# Altium project Laser Power Meter.PrjPcb (part 1 of 2)
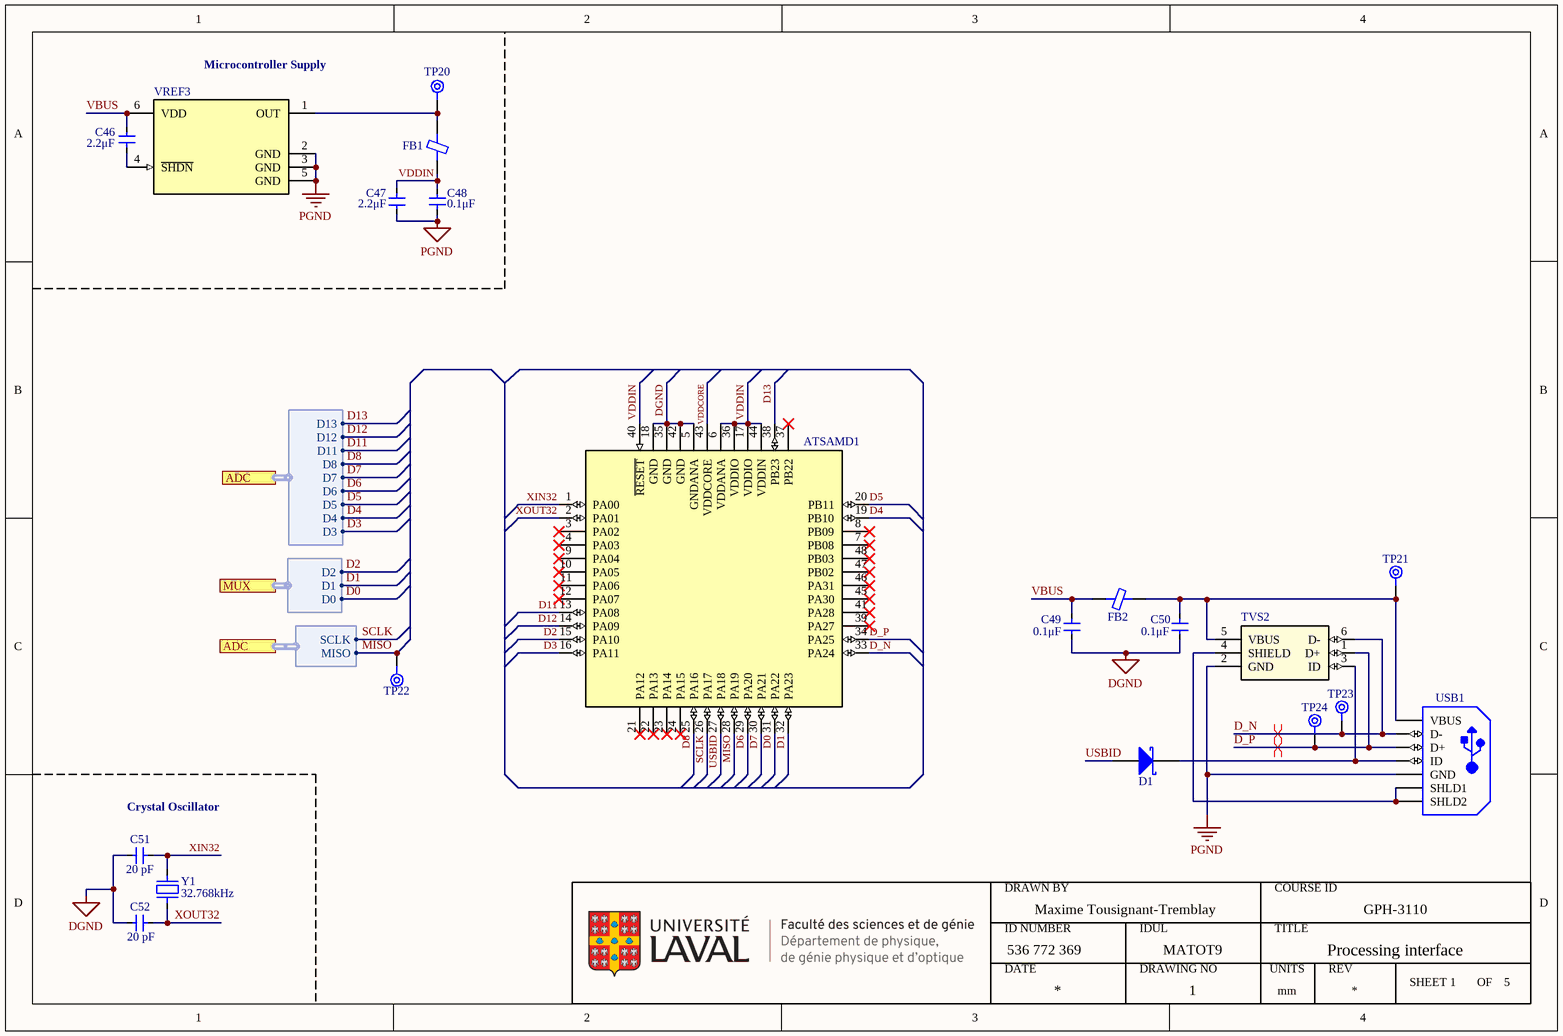
[diagram p0: Arduino.SchDoc]
Author: Maxime Tousignant-Tremblay; CAGE_CODE: ?????; CONTRACT_NUMBER: <CONTRACT NO>; CourseID: GPH-3110; DOC_NO_ASSY_DWG: <ASSY DWG NO>; DOC_NO_BOM: <BOM DOC NO>; DOC_NO_FAB_DWG: <FAB DWG NO>; DOC_NO_SCH_DWG: <SCH DWG NO>; DrawnBy: Maxime Tousignant-Tremblay; ID Number: 536 772 369; IDUL: MATOT9; PCB_2_DEC_TOL: +/-.01; PCB_3_DEC_TOL: +/-.010; PCB_ANG_TOL: +/-1/2; PCB_ASSEMBLY_NO: <PCB ASSY NO>; PCB_CHECKER: - -----; PCB_CHECKER_APP_DATE: --/--/----; PCB_DESIGNER: - -----; PCB_DESIGNER_APP_DATE: --/--/----; PCB_DWG_NO: <PCB DWG NO>; PCB_ENGINEER: - -----; PCB_ENGINEER_APP_DATE: --/--/----; PCB_PART_NUMBER: <PCB PN>; PCB_REV: A; SCH_REV: A; SheetNumber: =SheetNumber; Units: mm
5 sheets, 152 parts. Net scope: flat (ports and power ports of the same name join across sheets).
Board file: 4 Layers Motherboard.PcbDoc
Sheets:
  Arduino.SchDoc
  Power Supply Unit.SchDoc
  Wheatstone bridge part I.SchDoc
  Wheatstone bridge part II.SchDoc
  Wheatstone bridge part III.SchDoc

## Sheet Arduino.SchDoc: Processing interface
size A4; SheetNumber: 1; SheetTotal: 5; ENG_APP_DATE: --/--/--; DSN_APP_DATE: --/--/--; CHK_APP_DATE: --/--/--; SPICEModelCacheCJHNTGTK: <root> / <DocumentId>CJHNTGTK</DocumentId> / </root>

### Parts
ATSAMD1  (no value)  [ATSAMD21G18-AU]
C46  value 2.2μF  [Cap Ceramic 2.2 uF 6.3V SMT 0603]  (hidden comment: Cap Ceramic 2.2 uF SMT 0603)
C47  value 2.2μF  [Cap Ceramic 2.2 uF 6.3V SMT 0603]  (hidden comment: CC0603KRX7R5BB225)
C48  Capacitance: 0.1μF  [Cap Ceramic 0.1 uF 50V SMT 0603]  (hidden comment: Cap Ceramic 0.1 uF SMT 0603)
C49  Capacitance: 0.1μF  [Cap Ceramic 0.1 uF 50V SMT 0603]  (hidden comment: Cap Ceramic 0.1 uF SMT 0603)
C50  Capacitance: 0.1μF  [Cap Ceramic 0.1 uF 50V SMT 0603]  (hidden comment: Cap Ceramic 0.1 uF SMT 0603)
C51  Capacitance: 20 pF  [Capacitor 20 pF SMT 0603]  (hidden comment: CC0603JRNPO9BN200)
C52  Capacitance: 20 pF  [Capacitor 20 pF SMT 0603]  (hidden comment: CC0603JRNPO9BN200)
D1  NSR0530HT1G  [Schottky Diode 30V SMT]  (value not drawn)
FB1  MFBM1V1608-000-R  [Eaton Ferrite Bead 0603]  (value not drawn)
FB2  MFBM1V1608-000-R  [Eaton Ferrite Bead 0603]  (value not drawn)
TP20  Test Point  [SQ Pad]  (value not drawn)  (no BOM)
TP21  Test Point  [SQ Pad]  (value not drawn)  (no BOM)
TP22  Test Point  [SQ Pad]  (value not drawn)  (no BOM)
TP23  Test Point  [SQ Pad]  (value not drawn)  (no BOM)
TP24  Test Point  [SQ Pad]  (value not drawn)  (no BOM)
TVS2  USB OTG TVS Diode Array 25V Clamp SMD  [RCLAMP0504FA.TCT]  (value not drawn)
USB1  USB3106-30-0230-A  [USB Micro-AB Connector B]  (value not drawn)
VREF3  Voltage Reference Series Fixed 3.3V  [MCP1501T-XXE/CHY]  (value not drawn)
Y1  value 32.768kHz  [ABS07-120-32.768KHZ-T A]  (hidden comment: ABS07-120-32.768KHZ-T)

### Ports
ADC (harness 2), ADC (harness 19), MUX (harness 0)

### Harnesses
2: D3, D4, D5, D6, D7, D8, D11, D12, D13
0: D2, D1, D0
19: SCLK, MISO

### Nets
DGND: ATSAMD1.5(GNDANA) ATSAMD1.18(GND) ATSAMD1.35(GND) ATSAMD1.42(GND) C47.1 C48.2 C49.1 C50.1 C51.1 C52.1 TVS2.2(GND) USB1.5(GND) VREF3.2(GND) VREF3.3(GND) VREF3.5(GND)  [also labelled PGND]
D0: ATSAMD1.31(PA22) ; port MUX.D0
D1: ATSAMD1.32(PA23) ; port MUX.D1
D2: ATSAMD1.15(PA10) ; port MUX.D2
D3: ATSAMD1.16(PA11) ; port ADC.D3
D4: ATSAMD1.19(PB10) ; port ADC.D4
D5: ATSAMD1.20(PB11) ; port ADC.D5
D6: ATSAMD1.29(PA20) ; port ADC.D6
D7: ATSAMD1.30(PA21) ; port ADC.D7
D8: ATSAMD1.25(PA16) ; port ADC.D8
D11: ATSAMD1.13(PA08) ; port ADC.D11
D12: ATSAMD1.14(PA09) ; port ADC.D12
D13: ATSAMD1.38(PB23) ; port ADC.D13
D_N: ATSAMD1.33(PA24) TP23.1(TP) TVS2.6(D-) USB1.2(D-)
D_P: ATSAMD1.34(PA25) TP24.1(TP) TVS2.1(D+) USB1.3(D+)
MISO: ATSAMD1.28(PA19) TP22.1(TP) ; port ADC.MISO
SCLK: ATSAMD1.26(PA17) ; port ADC.SCLK
USBID: ATSAMD1.27(PA18) D1.2
VBUS: C46.1 C49.2 FB2.2 VREF3.6(VDD)
VDDCORE: ATSAMD1.43(VDDCORE)
VDDIN: ATSAMD1.6(VDDANA) ATSAMD1.17(VDDIO) ATSAMD1.36(VDDIO) ATSAMD1.40(~{RESET}) ATSAMD1.44(VDDIN) C47.2 C48.1 FB1.1
XIN32: ATSAMD1.1(PA00) C51.2 Y1.2
XOUT32: ATSAMD1.2(PA01) C52.2 Y1.1
NetC46_2: C46.2 VREF3.4(~{SHDN})
NetC50_2: C50.2 FB2.1 TP21.1(TP) TVS2.5(VBUS) USB1.1(VBUS)
NetD1_1: D1.1 TVS2.3(ID) USB1.4(ID)
NetFB1_2: FB1.2 TP20.1(TP) VREF3.1(OUT)
NetTVS2_4: TVS2.4(SHIELD) USB1.6(SHLD1) USB1.7(SHLD2)

Not connected (* = marked no-connect by the designer): ATSAMD1 3(PA02)* 4(PA03)* 7(PB08)* 8(PB09)* 9(PA04)* 10(PA05)* 11(PA06)* 12(PA07)* 21(PA12)* 22(PA13)* 23(PA14)* 24(PA15)* 37(PB22)* 39(PA27)* 41(PA28)* 45(PA30)* 46(PA31)* 47(PB02)* 48(PB03)*

### Layout directives
differential pair: D_N, D_P

### Notes on the sheet
- (near VREF3) Microcontroller Supply
- Crystal Oscillator
- DRAWN BY
- COURSE ID
- ID NUMBER
- DATE
- IDUL
- DRAWING NO
- TITLE
- UNITS
- REV
- SHEET
- OF

### Library data of the parts
ATSAMD1 = ATSAMD21G18A-AU: ARM® Cortex®-M0+ SAM D21G, Functional Safety (FuSa) Microcontroller IC 32-Bit Single-Core 48MHz 256KB (256K x 8) FLASH 48-TQFP (7x7); Supplier 1: Digi-Key; Supplier Part Number 1: ATSAMD21G18A-AU-ND; ComponentLink1Description: Datasheet; ComponentLink1URL: https://ww1.microchip.com/downloads/en/DeviceDoc/SAM-D21-DA1-Family-Data-Sheet-DS40001882H.pdf; ComponentLink2Description: Arduino Zero; ComponentLink2URL: https://docs.arduino.cc/hardware/zero
C46 = Cap Ceramic 2.2 uF SMT 0603: 2.2 µF ±10% 6.3V Ceramic Capacitor X7R 0603 (1608 Metric); Part Number: CC0603KRX7R5BB225; manufacturer: Yageo; Applications: General Purpose; ComponentLink1Description: Datasheet; ComponentLink1URL: *; componentlink2description: DigiKey Link; componentlink2url: https://www.digikey.com/en/products/detail/yageo/CC0603KRX7R5BB225/5195203; Device Package: 0603 (1608 Metric); lastupdated: 2023-03-06 20:08:32; Lifecycle Status: Active; Minimum Order: 1; Mounting Type: Surface Mount, MLCC; Operating Temperature: -55°C ~ 125°C; Package / Case: 0603 (1608 Metric); packaging: TapeAndReel; partid: 41539; Part Status: Active; price: 0.01; series: CC; Size / Dimension: 0.063" L x 0.031" W (1.60mm x 0.80mm); Temperature Coefficient: X7R; Thickness (Max): 0.035" (0.90mm); Tolerance: ±10%; Voltage - Rated: 6.3V; Supplier 1: Digi-Key; Supplier Part Number 1: 311-1795-1-ND; Supplier 2: Digi-Key; Supplier Part Number 2: 311-1795-6-ND; Supplier 3: Digi-Key; Supplier Part Number 3: 311-1795-2-ND
C47 = Cap Ceramic 2.2 uF SMT 0603: 2.2 µF ±10% 6.3V Ceramic Capacitor X7R 0603 (1608 Metric); manufacturer: Yageo; Part Number: CC0603KRX7R5BB225; Applications: General Purpose; ComponentLink1Description: Datasheet; ComponentLink1URL: *; componentlink2description: DigiKey Link; componentlink2url: https://www.digikey.com/en/products/detail/yageo/CC0603KRX7R5BB225/5195203; Device Package: 0603 (1608 Metric); lastupdated: 2023-03-06 20:08:32; Lifecycle Status: Active; Minimum Order: 1; Mounting Type: Surface Mount, MLCC; Operating Temperature: -55°C ~ 125°C; Package / Case: 0603 (1608 Metric); packaging: TapeAndReel; partid: 41539; Part Status: Active; price: 0.01; series: CC; Size / Dimension: 0.063" L x 0.031" W (1.60mm x 0.80mm); Temperature Coefficient: X7R; Thickness (Max): 0.035" (0.90mm); Tolerance: ±10%; Voltage - Rated: 6.3V; Supplier 1: Digi-Key; Supplier Part Number 1: 311-1795-1-ND; Supplier 2: Digi-Key; Supplier Part Number 2: 311-1795-6-ND; Supplier 3: Digi-Key; Supplier Part Number 3: 311-1795-2-ND
C48-C50 = Cap Ceramic 0.1 uF SMT 0603: 0.1 µF ±5% 50V Ceramic Capacitor X7R 0603 (1608 Metric); Part Number: CC0603JRX7R9BB104; manufacturer: Yageo; Applications: General Purpose; componentlink1description: Datasheet; componentlink1url: https://www.yageo.com/upload/media/product/productsearch/datasheet/mlcc/UPY-GPHC_X7R_6.3V-to-50V_18.pdf; componentlink2description: DigiKey Link; componentlink2url: https://www.digikey.com/en/products/detail/yageo/CC0603JRX7R9BB104/5195188; Device Package: 0603 (1608 Metric); lastupdated: 2023-03-06 20:08:09; Lifecycle Status: Active; Minimum Order: 1; Mounting Type: Surface Mount, MLCC; Operating Temperature: -55°C ~ 125°C; Package / Case: 0603 (1608 Metric); packaging: TapeAndReel; partid: 12474; Part Status: Active; price: 0.01; series: CC; Size / Dimension: 0.063" L x 0.031" W (1.60mm x 0.80mm); Temperature Coefficient: X7R; Thickness (Max): 0.035" (0.90mm); Tolerance: ±5%; Voltage - Rated: 50V; Supplier 1: Digi-Key; Supplier Part Number 1: 311-1779-1-ND; Supplier 2: Digi-Key; Supplier Part Number 2: 311-1779-6-ND; Supplier 3: Digi-Key; Supplier Part Number 3: 311-1779-2-ND
C51 C52 = Cap Ceramic 20 pF SMT 0603: 20 pF ±5% 50V Ceramic Capacitor C0G, NP0 0603 (1608 Metric); manufacturer: Yageo; Part Number: CC0603JRNPO9BN200; Applications: General Purpose; componentlink1description: Datasheet; componentlink1url: https://www.yageo.com/upload/media/product/productsearch/datasheet/mlcc/UPY-GP_NP0_16V-to-50V_17.pdf; componentlink2description: DigiKey Link; componentlink2url: https://www.digikey.com/en/products/detail/yageo/CC0603JRNPO9BN200/2833589; Device Package: 0603 (1608 Metric); lastupdated: 2023-03-06 20:07:50; Lifecycle Status: Active; Minimum Order: 1; Mounting Type: Surface Mount, MLCC; Operating Temperature: -55°C ~ 125°C; Package / Case: 0603 (1608 Metric); packaging: TapeAndReel; partid: 16728; Part Status: Active; price: 0.01; series: CC; Size / Dimension: 0.063" L x 0.031" W (1.60mm x 0.80mm); Temperature Coefficient: C0G, NP0; Thickness (Max): 0.035" (0.90mm); Tolerance: ±5%; Voltage - Rated: 50V; Supplier 1: Digi-Key; Supplier Part Number 1: 311-1424-1-ND; Supplier 2: Digi-Key; Supplier Part Number 2: 311-1424-6-ND; Supplier 3: Digi-Key; Supplier Part Number 3: 311-1424-2-ND
D1 = Schottky Diode 30V: Schottky Diode 30 V 500mA Surface Mount SOD-323; Manufacturer: ON Semiconductor; Capacitance @ Vr, F: 10pF @ 1V, 1MHz; Current - Average Rectified (Io): 500mA (DC); Current - Reverse Leakage @ Vr: 200µA @ 30V; Speed: Fast Recovery =< 500ns, > 200mA (Io); Voltage - DC Reverse (Vr) (Max): 30V; Voltage - Forward (Vf) (Max) @ If: 620mV @ 500mA; Part Number: NSR0530HT1G; ComponentLink1Description: Datasheet; ComponentLink1URL: http://www.onsemi.com/pub/Collateral/NSR0530H-D.PDF; ComponentLink2Description: DigiKey Link; ComponentLink2URL: http://digikey.com/product-detail/en/on-semiconductor/NSR0530HT1G/NSR0530HT1GOSCT-ND/5761654; Diode Type: Schottky; LastUpdated: 2023-03-06 21:08:52; Lifecycle Status: Active; Minimum Order: 1; Mounting Type: Surface Mount; Operating Temperature - Junction: -55°C ~ 150°C; Package / Case: SC-76, SOD-323; Packaging: TapeAndReel; PartId: 3077; Part Status: Active; Price: 0.03; Series: -; Supplier Device Package: SOD-323; Supplier 1: Digi-Key; Supplier Part Number 1: NSR0530HT1GOSCT-ND; Supplier 2: Digi-Key; Supplier Part Number 2: NSR0530HT1GOSDKR-ND; Supplier 3: Digi-Key; Supplier Part Number 3: NSR0530HT1GOSTR-ND
FB1 FB2 = Ferrite Bead 0R SMD 0603: 0Ω 1 Power Line Ferrite Bead 0603 (1608 Metric) 6A 20mOhm; Manufacturer: Eaton - Electronics Division; Impedance @ Frequency: 0 Ohms @ 100 MHz; Number of Lines: 1; Value: 0 Ohms @ 100 MHz; Part Number: MFBM1V1608-000-R; ComponentLink1Description: Datasheet; ComponentLink1URL: https://www.eaton.com/content/dam/eaton/products/electronic-components/resources/data-sheet/eaton-mfbm1v1608-high-current-multilayer-ferrite-chip-bead-data-sheet.pdf; ComponentLink2Description: DigiKey Link; ComponentLink2URL: https://www.digikey.com/en/products/detail/eaton-electronics-division/MFBM1V1608-000-R/13161356; Current Rating (Max): 6A; DC Resistance (DCR) (Max): 20mOhm; Device Package: 0603 (1608 Metric); Filter Type: Power Line; Height (Max): 0.039" (1.00mm); LastUpdated: 2023-03-12 7:51:35 PM; Lifecycle Status: Active; Minimum Order: 1; Mounting Type: Surface Mount; Operating Temperature: -40°C ~ 85°C; Package / Case: 0603 (1608 Metric); Packaging: TapeAndReel; PartId: 2605; Part Status: Active; Price: 0.01; Series: MFBM1V1608; Size / Dimension: 0.063" L x 0.031" W (1.60mm x 0.80mm); Supplier 1: Digi-Key; Supplier Part Number 1: 283-MFBM1V1608-000-RCT-ND; Supplier 2: Digi-Key; Supplier Part Number 2: 283-MFBM1V1608-000-RDKR-ND
TVS2 = USB OTG TVS Diode Array 25V Clamp SMD: 25V Clamp 6A (8/20µs) Ipp Tvs Diode Surface Mount SC-70-6; Supplier 1: Digi-Key; Supplier Part Number 1: RCLAMP0504FATCTCT-ND; Supplier 2: Digi-Key; Supplier Part Number 2: RCLAMP0504FATCTDKR-ND; Supplier 3: Digi-Key; Supplier Part Number 3: RCLAMP0504FATCTTR-ND
USB1 = USB Micro-AB Connector A: USB - Micro AB 2.0 Receptacle Connector 5 Position, Vertical, Through Hole with 2.30 mm (Standard) Shell Stakes, 5-Pin THD, RoHS, Tape and Reel; Supplier 1: Newark; Supplier Part Number 1: 18X0232
VREF3 = Voltage Reference Series Fixed 3.3V: Series Voltage Reference IC Fixed 3.3V V ±0.1% 20 mA SOT-23-6; Temperature Coefficient: 50ppm/°C; Output Current: 20mA; Tolerance: 0.08%; Operating Supply Current: 550μA; ComponentLink1Description: Datasheet; ComponentLink1URL: https://ww1.microchip.com/downloads/aemDocuments/documents/MSLD/ProductDocuments/DataSheets/MCP1501-Data-Sheet-DS20005474F.pdf; Reference Type: Series; Case/Package: SOT-23-6; Output Type: Fixed; Min Output Voltage: 3.3V; Min Operating Temperature: -40°C; Max Operating Temperature: 125°C; Supplier 1: Digi-Key; Supplier Part Number 1: MCP1501T-33E/CHYCT-ND; Supplier 2: Digi-Key; Supplier Part Number 2: MCP1501T-33E/CHYDKR-ND; Supplier 3: Digi-Key; Supplier Part Number 3: MCP1501T-33E/CHYTR-ND
Y1 = Crystal Abracon ABS07: 32.768 kHz ±20ppm Crystal 6pF 55 kOhms 2-SMD, No Lead; Manufacturer: Abracon LLC; Operating Mode: Fundamental; Part Number: ABS07-120-32.768KHZ-T; ComponentLink1Description: Datasheet; ComponentLink1URL: https://abracon.com/Resonators/ABS07-120-32.768kHz-T.pdf; ComponentLink2Description: DigiKey Link; ComponentLink2URL: https://www.digikey.com/en/products/detail/abracon-llc/ABS07-120-32-768KHZ-T/3724043; ESR (Equivalent Series Resistance): 55 kOhms; Frequency Tolerance: ±20ppm; Height - Seated (Max): 0.035" (0.90mm); LastUpdated: 2023-03-06 20:57:22; Lifecycle Status: Active; Load Capacitance: 6pF; Minimum Order: 1; Mounting Type: Surface Mount; Operating Temperature: -40°C ~ 85°C; Package / Case: 2-SMD, No Lead; Packaging: TapeAndReel; PartId: 385; Part Status: Active; Price: 0.44; Series: ABS07; Size / Dimension: 0.126" L x 0.059" W (3.20mm x 1.50mm); Type: kHz Crystal (Tuning Fork); Supplier 1: Digi-Key; Supplier Part Number 1: 535-11937-1-ND; Supplier 2: Digi-Key; Supplier Part Number 2: 535-11937-6-ND; Supplier 3: Digi-Key; Supplier Part Number 3: 535-11937-2-ND; Frequency: 32.768 kHz

## Sheet Power Supply Unit.SchDoc: Power Supply Unit
size A4; SPICEModelCacheSEIOAEZJ: <root> / <DocumentId>SEIOAEZJ</DocumentId> / </root>; DrawnBy: Maxime Tousignant-Tremblay; Revision: 1; SheetNumber: 2; SheetTotal: 5; Units: mm
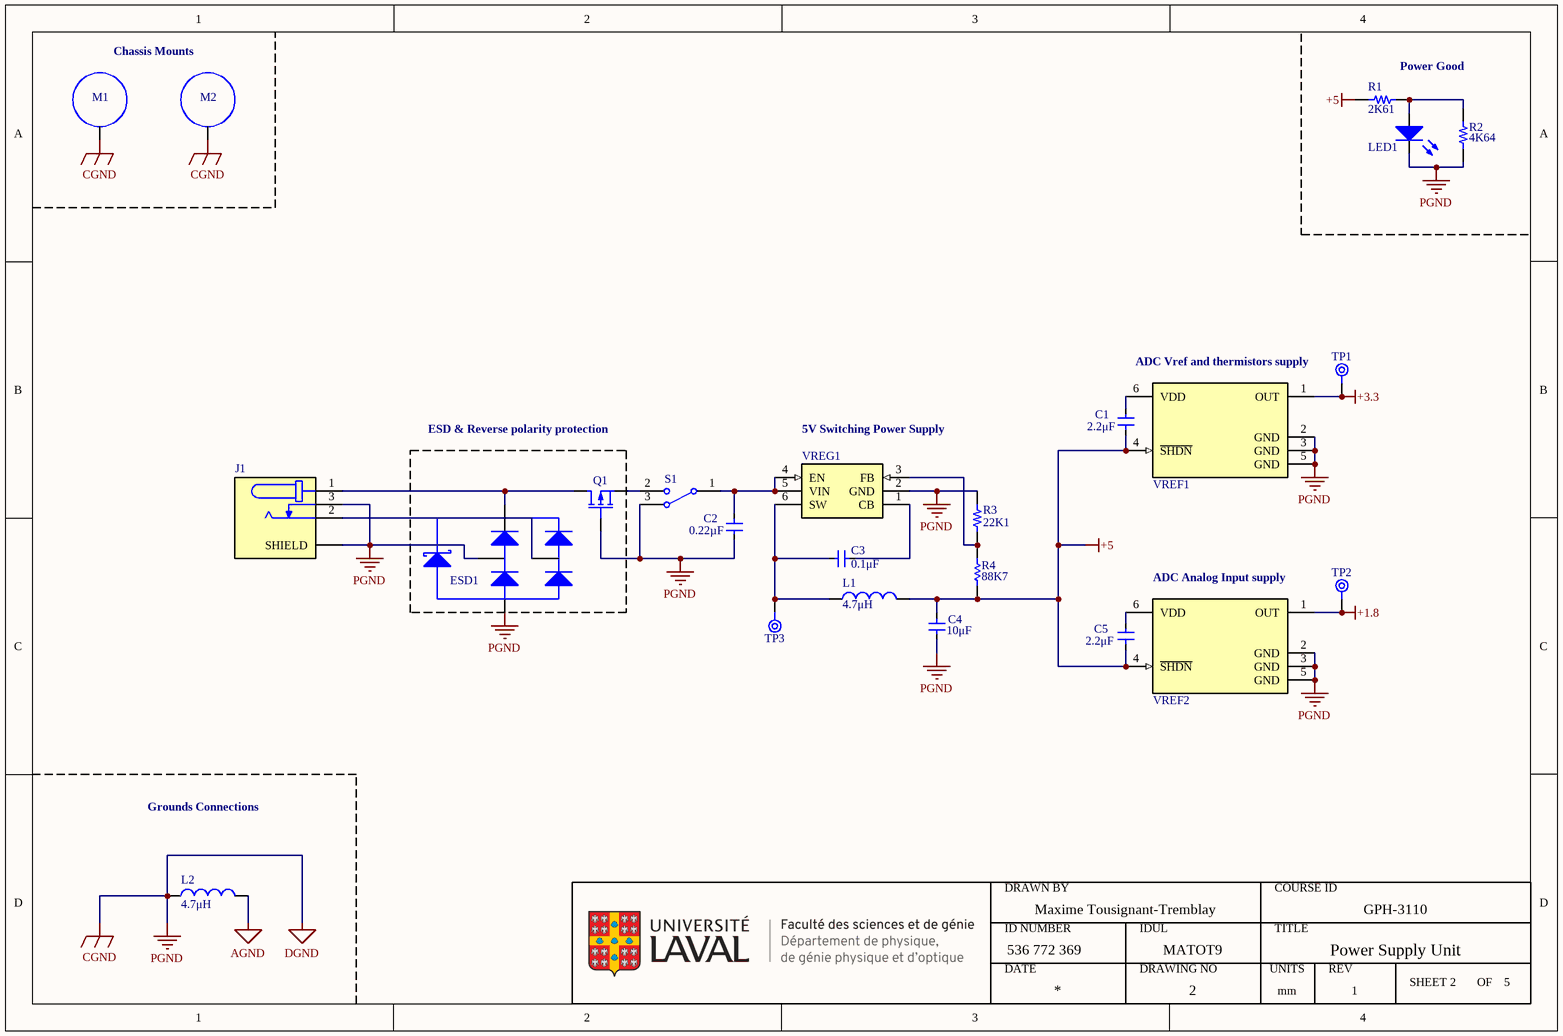
[diagram p1: Power Supply Unit.SchDoc]

### Parts
C1  value 2.2μF  [Cap Ceramic 2.2 uF 6.3V SMT 0603]  (hidden comment: Cap Ceramic 2.2 uF SMT 0603)
C2  Capacitance: 0.22µF  [Cap Ceramic 0.22 uF 25V SMT 0603]  (hidden comment: Cap Ceramic 0.22 uF SMT 0603)
C3  Capacitance: 0.1μF  [Cap Ceramic 0.1 uF 50V SMT 0603]  (hidden comment: Cap Ceramic 0.1 uF SMT 0603)
C4  Capacitance: 10μF  [Cap Ceramic 10 uF SMT 0603]  (hidden comment: GRM188R60J106KE47J)
C5  value 2.2μF  [Cap Ceramic 2.2 uF 6.3V SMT 0603]  (hidden comment: Cap Ceramic 2.2 uF SMT 0603)
ESD1  PRTR5V0U2X,215  [TVS Diode Array Ultra-Low Capacitance]  (value not drawn)
J1  PJ-090BH  [DC Power Jack 2.5 mm]  (value not drawn)
L1  value 4.7μH  [Inductor 4.7 uH SMT 0603]  (hidden comment: ILSB0603ER4R7K)
L2  value 4.7μH  [Inductor 4.7 uH SMT 0603]  (hidden comment: ILSB0603ER4R7K)
LED1  151033GS03000  [Led 3 mm Vertical Clear]  (value not drawn)
M1  R30-3000702  [Keystone Square Washer pad]  (value not drawn)
M2  R30-3000702  [Keystone Square Washer pad]  (value not drawn)
Q1  IRLML9303TRPBF  [IRLML9303TRPBF]  (value not drawn)
R1  value 2K61  [Resistor Yaego SMT 0603]  (hidden comment: RC0603FR-072K61L)
R2  value 4K64  [Resistor Yaego SMT 0603]  (hidden comment: RC0603FR-074K64L)
R3  Resistance: 22K1  [Resistor Yaego SMT 0603]  (hidden comment: Res 22K1 SMT 0603)
R4  Resistance: 88K7  [Res 88K7 1% SMT 0603]  (hidden comment: Res 88K7 SMT 0603)
S1  TL2230EEF100  [SW DPDT Pushbutton]  (value not drawn)
TP1  Test Point  [SQ Pad]  (value not drawn)  (no BOM)
TP2  Test Point  [SQ Pad]  (value not drawn)  (no BOM)
TP3  Test Point  [SQ Pad]  (value not drawn)  (no BOM)
VREF1  Voltage Reference Series Fixed 3.3V  [MCP1501T-XXE/CHY]  (value not drawn)
VREF2  Voltage Reference Series Fixed 1.8V  [MCP1501T-XXE/CHY]  (value not drawn)
VREG1  Buck Adjustable Switching Reg Pos  [LMR50410YFQDBVRQ1]  (value not drawn)

### Blocks framed on the sheet
ESD & Reverse polarity protection: ESD1 Q1

### Nets
+1.8: TP2.1(TP) VREF2.1(OUT)
+3.3: TP1.1(TP) VREF1.1(OUT)
+5: C1.2 C4.2 C5.2 L1.2 R1.1 R4.2 VREF1.4(~{SHDN}) VREF2.4(~{SHDN})
AGND: L2.2
DGND: C2.1 C4.1 ESD1.1(GND) ESD1.2(I/O_1) J1.3 J1.S1(SHIELD) L2.1 LED1.1(K) M1.1(CGND) M2.1(CGND) Q1.2(G) R2.1 R3.2 S1.3(NO1) VREF1.2(GND) VREF1.3(GND) VREF1.5(GND) VREF2.2(GND) VREF2.3(GND) VREF2.5(GND) VREG1.2(GND)  [also labelled CGND, PGND]
NetC1_1: C1.1 VREF1.6(VDD)
NetC2_2: C2.2 S1.1(NC1) VREG1.4(EN) VREG1.5(VIN)
NetC3_1: C3.1 L1.1 TP3.1(TP) VREG1.6(SW)
NetC3_2: C3.2 VREG1.1(CB)
NetC5_1: C5.1 VREF2.6(VDD)
NetESD1_3: ESD1.3(I/O_2) J1.2
NetESD1_4: ESD1.4(VCC) J1.1 Q1.1(D)
NetLED1_2: LED1.2(A) R1.2 R2.2
NetQ1_3: Q1.3(S) S1.2(COM1)
NetR3_1: R3.1 R4.1 VREG1.3(FB)

### Notes on the sheet
- Chassis Mounts
- (near R1) Power Good
- ADC Vref and thermistors supply
- (near VREG1) 5V Switching Power Supply
- (near VREF2) ADC Analog Input supply
- Grounds Connections
- DRAWN BY
- COURSE ID
- ID NUMBER
- DATE
- IDUL
- DRAWING NO
- TITLE
- UNITS
- REV
- SHEET
- OF

### Library data of the parts
C1 C5 = Cap Ceramic 2.2 uF SMT 0603: as C46 on sheet Arduino; Applications: General Purpose; ComponentLink1Description: Datasheet; ComponentLink1URL: *; componentlink2description: DigiKey Link; componentlink2url: https://www.digikey.com/en/products/detail/yageo/CC0603KRX7R5BB225/5195203; Device Package: 0603 (1608 Metric); lastupdated: 2023-03-06 20:08:32; Lifecycle Status: Active; Minimum Order: 1; Mounting Type: Surface Mount, MLCC; Operating Temperature: -55°C ~ 125°C; Package / Case: 0603 (1608 Metric); packaging: TapeAndReel; partid: 41539; Part Status: Active; price: 0.01; series: CC; Size / Dimension: 0.063" L x 0.031" W (1.60mm x 0.80mm); Temperature Coefficient: X7R; Thickness (Max): 0.035" (0.90mm); Tolerance: ±10%; Voltage - Rated: 6.3V; Supplier 1: Digi-Key; Supplier Part Number 1: 311-1795-1-ND; Supplier 2: Digi-Key; Supplier Part Number 2: 311-1795-6-ND; Supplier 3: Digi-Key; Supplier Part Number 3: 311-1795-2-ND
C2 = Cap Ceramic 0.22 uF SMT 0603: 0.22 µF ±10% 25V Ceramic Capacitor X7R 0603 (1608 Metric); Part Number: GRM188R71E224KA88D; manufacturer: Murata Electronics; Applications: General Purpose; componentlink1description: Datasheet; componentlink1url: https://www.murata.com/~/media/webrenewal/support/library/catalog/products/capacitor/mlcc/c02e.ashx?la=en-us; componentlink2description: DigiKey Link; componentlink2url: https://www.digikey.com/en/products/detail/murata-electronics/GRM188R71E224KA88D/702554; Device Package: 0603 (1608 Metric); lastupdated: 2023-03-05 20:08:17; Lifecycle Status: Active; Minimum Order: 1; Mounting Type: Surface Mount, MLCC; Operating Temperature: -55°C ~ 125°C; Package / Case: 0603 (1608 Metric); packaging: TapeAndReel; partid: 11196; Part Status: Active; price: 0.01; series: GRM; Size / Dimension: 0.063" L x 0.031" W (1.60mm x 0.80mm); Temperature Coefficient: X7R; Thickness (Max): 0.035" (0.90mm); Tolerance: ±10%; Voltage - Rated: 25V; Supplier 1: Digi-Key; Supplier Part Number 1: 490-3290-1-ND; Supplier 2: Digi-Key; Supplier Part Number 2: 490-3290-6-ND; Supplier 3: Digi-Key; Supplier Part Number 3: 490-3290-2-ND
C3 = Cap Ceramic 0.1 uF SMT 0603: as C48 on sheet Arduino; Applications: General Purpose; componentlink1description: Datasheet; componentlink1url: https://www.yageo.com/upload/media/product/productsearch/datasheet/mlcc/UPY-GPHC_X7R_6.3V-to-50V_18.pdf; componentlink2description: DigiKey Link; componentlink2url: https://www.digikey.com/en/products/detail/yageo/CC0603JRX7R9BB104/5195188; Device Package: 0603 (1608 Metric); lastupdated: 2023-03-06 20:08:09; Lifecycle Status: Active; Minimum Order: 1; Mounting Type: Surface Mount, MLCC; Operating Temperature: -55°C ~ 125°C; Package / Case: 0603 (1608 Metric); packaging: TapeAndReel; partid: 12474; Part Status: Active; price: 0.01; series: CC; Size / Dimension: 0.063" L x 0.031" W (1.60mm x 0.80mm); Temperature Coefficient: X7R; Thickness (Max): 0.035" (0.90mm); Tolerance: ±5%; Voltage - Rated: 50V; Supplier 1: Digi-Key; Supplier Part Number 1: 311-1779-1-ND; Supplier 2: Digi-Key; Supplier Part Number 2: 311-1779-6-ND; Supplier 3: Digi-Key; Supplier Part Number 3: 311-1779-2-ND
C4 = Cap Ceramic 10 uF SMT 0603: 10 µF ±10% 6.3V Ceramic Capacitor X5R 0603 (1608 Metric); manufacturer: Murata Electronics; Part Number: GRM188R60J106KE47J; Applications: General Purpose; componentlink2description: DigiKey Link; componentlink2url: https://www.digikey.com/en/products/detail/murata-electronics/GRM188R60J106KE47J/10691412; Device Package: 0603 (1608 Metric); lastupdated: 2023-03-08 20:07:22; Lifecycle Status: Active; Minimum Order: 1; Mounting Type: Surface Mount, MLCC; Operating Temperature: -55°C ~ 85°C; Package / Case: 0603 (1608 Metric); packaging: TapeAndReel; partid: 47219; Part Status: Active; price: 0.01; series: GRM; Size / Dimension: 0.063" L x 0.032" W (1.60mm x 0.80mm); Temperature Coefficient: X5R; Thickness (Max): 0.035" (0.90mm); Tolerance: ±10%; Voltage - Rated: 6.3V; Supplier 1: Digi-Key; Supplier Part Number 1: 490-GRM188R60J106KE47JCT-ND; Supplier 2: Digi-Key; Supplier Part Number 2: 490-GRM188R60J106KE47JDKR-ND; Supplier 3: Digi-Key; Supplier Part Number 3: 490-GRM188R60J106KE47JTR-ND
ESD1 = TVS Diode Array Ultra-Low Capacitance: Clamp Ipp Tvs Diode Surface Mount SOT-143B; Supplier 1: Digi-Key; Supplier Part Number 1: 1727-3884-1-ND; Supplier 2: Digi-Key; Supplier Part Number 2: 1727-3884-6-ND; Supplier 3: Digi-Key; Supplier Part Number 3: 1727-3884-2-ND
J1 = DC Power Jack 2.5 mm Vertical: Power Barrel Connector Jack 2.50mm ID (0.098"), 5.50mm OD (0.217") Through Hole; Current Rating: 5A; Voltage Rating: 25V; Shielding: Shielded; Contact Material: Brass, Copper Alloy; Max Operating Temperature: 85°C; Min Operating Temperature: -25°C; Supplier 1: Digi-Key; Supplier Part Number 1: 2223-PJ-090BHCT-ND; Supplier 2: Digi-Key; Supplier Part Number 2: 2223-PJ-090BHDKR-ND; Contact Material - Plating: Silver; Housing Material: Polyamide (PA10T), Nylon 10T; Supplier 3: Digi-Key; Supplier Part Number 3: 2223-PJ-090BHTR-ND
L1 L2 = Inductor 4.7 µH SMT 0603: 4.7 µH Shielded Multilayer Inductor 15 mA 2.1Ohm Max 0603 (1608 Metric); Tolerance: 10%; Core Material: Ferrite; Self Resonant Frequency: 41MHz; Case Code (Imperial): 1206; Min Operating Temperature: -55°C; Max Operating Temperature: 125°C; Width: 1.6mm; Depth: 1.8mm; Weight: 0.000353oz; ComponentLink1Description: Datasheet; ComponentLink1URL: https://www.vishay.com/docs/34029/ilsb1206.pdf; Supplier 1: Digi-Key; Supplier Part Number 1: 541-4369-1-ND; Supplier 2: Digi-Key; Supplier Part Number 2: 541-4369-6-ND
LED1 = LED Green 3mm 3.2V Vertical: Green 530nm LED Indication - Discrete 3.2V Radial; Supplier 1: Digi-Key; Supplier Part Number 1: 732-5012-ND; Operating Voltage: 3.2V
M1 M2 = Standoff M3 7mm: Hex Standoff Threaded M3x0.5 Brass 0.276" (7.00mm); Supplier 1: Digi-Key; Supplier Part Number 1: 952-1498-ND
Q1 = MOSFET P-Channel 30V SMD: P-Channel 30 V 2.3A (Ta) 1.25W (Ta) Surface Mount Micro3™/SOT-23; Manufacturer: Infineon Technologies; Drain to Source Voltage (Vdss): 30 V; Drive Voltage (Max Rds On,  Min Rds On): 4.5V, 10V; Gate Charge (Qg) (Max) @ Vgs: 2 nC @ 4.5 V; Input Capacitance (Ciss) (Max) @ Vds: 160 pF @ 25 V; Rds On (Max) @ Id, Vgs: 165mOhm @ 2.3A, 10V; Vgs (Max): ±20V; Vgs(th) (Max) @ Id: 2.4V @ 10µA; Part Number: IRLML9303TRPBF; ComponentLink1Description: Datasheet; ComponentLink1URL: https://www.infineon.com/dgdl/irlml9303pbf.pdf?fileId=5546d462533600a401535668ef1d2642; ComponentLink2Description: DigiKey Link; ComponentLink2URL: https://www.digikey.com/en/products/detail/infineon-technologies/IRLML9303TRPBF/2354147; Current - Continuous Drain (Id) @ 25°C: 2.3A (Ta); FET Type: P-Channel; LastUpdated: 2023-03-05 21:05:43; Lifecycle Status: Active; Minimum Order: 1; Mounting Type: Surface Mount; Operating Temperature: -55°C ~ 150°C (TJ); Package / Case: TO-236-3, SC-59, SOT-23-3; Packaging: TapeAndReel; Part Status: Active; Power Dissipation (Max): 1.25W (Ta); Price: 0.11; Series: HEXFET®; Supplier Device Package: Micro3™/SOT-23; Technology: MOSFET (Metal Oxide); Supplier 1: Digi-Key; Supplier Part Number 1: IRLML9303TRPBFCT-ND; Supplier 2: Digi-Key; Supplier Part Number 2: IRLML9303TRPBFDKR-ND; Supplier 3: Digi-Key; Supplier Part Number 3: IRLML9303TRPBFTR-ND
R1 = Res 2K61 1% SMT 0603: 2.61 kOhms ±1% 0.1W, 1/10W Chip Resistor 0603 (1608 Metric) Moisture Resistant Thick Film; Manufacturer: Yageo; Temperature Coefficient: ±100ppm/°C; Part Number: RC0603FR-072K61L; ComponentLink1Description: Datasheet; ComponentLink1URL: https://www.yageo.com/upload/media/product/productsearch/datasheet/rchip/PYu-RC_Group_51_RoHS_L_10.pdf; ComponentLink2Description: DigiKey Link; ComponentLink2URL: https://www.digikey.com/en/products/detail/yageo/RC0603FR-072K61L/727030; Composition: Thick Film; Device Package: 0603 (1608 Metric); Features: Moisture Resistant; Height - Seated (Max): 0.022" (0.55mm); LastUpdated: 2023-03-10 20:29:10; Lifecycle Status: Active; Minimum Order: 1; Number of Terminations: 2; Operating Temperature: -55°C ~ 155°C; Package / Case: 0603 (1608 Metric); Packaging: CutTape; PartId: 19094; Part Status: Active; Power (Watts): 0.1W, 1/10W; Price: 0.01; Resistance: 2K61; Series: RC_L; Size / Dimension: 0.063" L x 0.031" W (1.60mm x 0.80mm); Supplier Device Package: 0603; Tolerance: ±1%; Supplier 1: Digi-Key; Supplier Part Number 1: 311-2.61KHRCT-ND; Supplier 2: Digi-Key; Supplier Part Number 2: 311-2.61KHRDKR-ND; Supplier 3: Digi-Key; Supplier Part Number 3: 311-2.61KHRTR-ND
R2 = Res 4K64 1% SMT 0603: 4.64 kOhms ±1% 0.1W, 1/10W Chip Resistor 0603 (1608 Metric) Moisture Resistant Thick Film; Manufacturer: Yageo; Temperature Coefficient: ±100ppm/°C; Part Number: RC0603FR-074K64L; ComponentLink1Description: Datasheet; ComponentLink1URL: https://www.yageo.com/upload/media/product/productsearch/datasheet/rchip/PYu-RC_Group_51_RoHS_L_10.pdf; ComponentLink2Description: DigiKey Link; ComponentLink2URL: https://www.digikey.com/en/products/detail/yageo/RC0603FR-074K64L/727211; Composition: Thick Film; Device Package: 0603 (1608 Metric); Features: Moisture Resistant; Height - Seated (Max): 0.022" (0.55mm); LastUpdated: 2023-03-10 20:29:36; Lifecycle Status: Active; Minimum Order: 1; Number of Terminations: 2; Operating Temperature: -55°C ~ 155°C; Package / Case: 0603 (1608 Metric); Packaging: CutTape; PartId: 12437; Part Status: Active; Power (Watts): 0.1W, 1/10W; Price: 0.01; Resistance: 4K64; Series: RC_L; Size / Dimension: 0.063" L x 0.031" W (1.60mm x 0.80mm); Supplier 1: DigiKey; Supplier Part Number 1: 311-4.64KHRCT-ND; Supplier Device Package: 0603; Tolerance: ±1%
R3 = Res 22K1 SMT 0603: RES 22.1K OHM 1% 1/10W 0603; Part Number: RC0603FR-0722K1L; Manufacturer: Yageo; Power (Watts): 0.1W, 1/10W; Temperature Coefficient: ±100ppm/°C; ComponentLink1Description: Datasheet; ComponentLink1URL: https://www.yageo.com/upload/media/product/productsearch/datasheet/rchip/PYu-RC_Group_51_RoHS_L_10.pdf; ComponentLink2Description: DigiKey Link; ComponentLink2URL: https://www.digikey.com/en/products/detail/yageo/RC0603FR-0722K1L/727058; Composition: Thick Film; Device Package: 0603 (1608 Metric); Features: Moisture Resistant; Height - Seated (Max): 0.022" (0.55mm); LastUpdated: 2023-03-08 20:29:23; Lifecycle Status: Active; Minimum Order: 1; Number of Terminations: 2; Operating Temperature: -55°C ~ 155°C; Package / Case: 0603 (1608 Metric); Packaging: CutTape; PartId: 19017; Part Status: Active; Price: 0.01; Series: RC_L; Size / Dimension: 0.063" L x 0.031" W (1.60mm x 0.80mm); Supplier Device Package: 0603; Tolerance: ±1%; Supplier 1: Digi-Key; Supplier Part Number 1: 311-22.1KHRCT-ND; Supplier 2: Digi-Key; Supplier Part Number 2: 311-22.1KHRDKR-ND; Supplier 3: Digi-Key; Supplier Part Number 3: 311-22.1KHRTR-ND; Value: 22K1
R4 = Res 88K7 SMT 0603: 88.7 kΩ ±1% 0.1W, 1/10W Chip Resistor 0603 (1608 Metric) Automotive AEC-Q200 Thick Film; Part Number: CRCW060388K7FKEB; Manufacturer: Vishay Dale; Temperature Coefficient: ±100ppm/°C; ComponentLink1Description: Datasheet; ComponentLink1URL: http://www.vishay.com/docs/20035/dcrcwe3.pdf; ComponentLink2Description: DigiKey Link; ComponentLink2URL: https://www.digikey.com/en/products/detail/vishay-dale/CRCW060388K7FKEB/5073407; Composition: Thick Film; Device Package: 0603 (1608 Metric); Features: Automotive AEC-Q200; Height - Seated (Max): 0.020" (0.50mm); LastUpdated: 2023-03-06 20:27:22; Lifecycle Status: Active; Minimum Order: 1; Number of Terminations: 2; Operating Temperature: -55°C ~ 155°C; Package / Case: 0603 (1608 Metric); Packaging: CutTape; PartId: 56612; Part Status: Active; Power (Watts): 0.1W, 1/10W; Price: 0.01; Ratings: AEC-Q200; Series: CRCW; Size / Dimension: 0.063" L x 0.033" W (1.60mm x 0.85mm); Supplier Device Package: 0603; Tolerance: ±1%; Supplier 1: Digi-Key; Supplier Part Number 1: 541-CRCW060388K7FKEBCT-ND; Supplier 2: Digi-Key; Supplier Part Number 2: 541-CRCW060388K7FKEBDKR-ND
S1 = SW DPDT Pushbutton V2: Pushbutton Switch DPDT Standard Through Hole; Published: 24-Mar-1999; LatestRevisionDate: 29-May-2009; LatestRevisionNote: IPC-7351 Footprint Added.; PackageVersion: Mar-2001; PackageReference: SOT23-6; Publisher: Altium Limited; PackageDescription: 6-Pin SOT-23 Package 0.95 mm Pitch, 2.7 mm Lead Span; Code_JEITA: SC-74; Code_IPC: SOT26A-6; Supplier 1: Digi-Key; Supplier Part Number 1: EG6030-ND
VREF1 = Voltage Reference Series Fixed 3.3V: as VREF3 on sheet Arduino; ComponentLink1Description: Datasheet; ComponentLink1URL: https://ww1.microchip.com/downloads/aemDocuments/documents/MSLD/ProductDocuments/DataSheets/MCP1501-Data-Sheet-DS20005474F.pdf; Reference Type: Series; Case/Package: SOT-23-6; Output Type: Fixed; Min Output Voltage: 3.3V; Min Operating Temperature: -40°C; Max Operating Temperature: 125°C; Supplier 1: Digi-Key; Supplier Part Number 1: MCP1501T-33E/CHYCT-ND; Supplier 2: Digi-Key; Supplier Part Number 2: MCP1501T-33E/CHYDKR-ND; Supplier 3: Digi-Key; Supplier Part Number 3: MCP1501T-33E/CHYTR-ND
VREF2 = Voltage Reference Series Fixed 1.8V: Series Voltage Reference IC Fixed 1.8V V ±0.1% 20 mA SOT-23-6; Temperature Coefficient: 50ppm/°C; Output Current: 20mA; Tolerance: 0.08%; Operating Supply Current: 550μA; ComponentLink1Description: Datasheet; ComponentLink1URL: https://ww1.microchip.com/downloads/aemDocuments/documents/MSLD/ProductDocuments/DataSheets/MCP1501-Data-Sheet-DS20005474F.pdf; Reference Type: Series; Case/Package: SOT-23-6; Output Type: Fixed; Min Output Voltage: 1.8V; Min Operating Temperature: -40°C; Max Operating Temperature: 125°C; Supplier 1: Digi-Key; Supplier Part Number 1: MCP1501T-18E/CHYCT-ND; Supplier 2: Digi-Key; Supplier Part Number 2: MCP1501T-18E/CHYDKR-ND
VREG1 = Buck Adjustable Switching Reg Pos: Buck Switching Regulator IC Positive Adjustable 1V 1 Output 1A SOT-23-6; Manufacturer_Name: Texas Instruments; Datasheet Link: https://www.ti.com/product/LMR50410-Q1; Height: 1.45mm; Manufacturer_Part_Number: LMR50410YFQDBVRQ1; Mouser Part Number: 595-MR50410YFQDBVRQ1; Mouser Price/Stock: https://www.mouser.co.uk/ProductDetail/Texas-Instruments/LMR50410YFQDBVRQ1?qs=81r%252BiQLm7BRUAgUFqYZycA%3D%3D; Arrow Part Number: LMR50410YFQDBVRQ1; Arrow Price/Stock: https://www.arrow.com/en/products/lmr50410yfqdbvrq1/texas-instruments?region=nac; Supplier 1: Digi-Key; Supplier Part Number 1: 296-LMR50410YFQDBVRQ1CT-ND; Supplier 2: Digi-Key; Supplier Part Number 2: 296-LMR50410YFQDBVRQ1DKR-ND; Supplier 3: Digi-Key; Supplier Part Number 3: 296-LMR50410YFQDBVRQ1TR-ND

## Sheet Wheatstone bridge part I.SchDoc: Wheatstone bridge part I
size A4; DrawnBy: Maxime Tousignant-Tremblay; Revision: 1; SheetNumber: 3; SheetTotal: 5; Units: mm
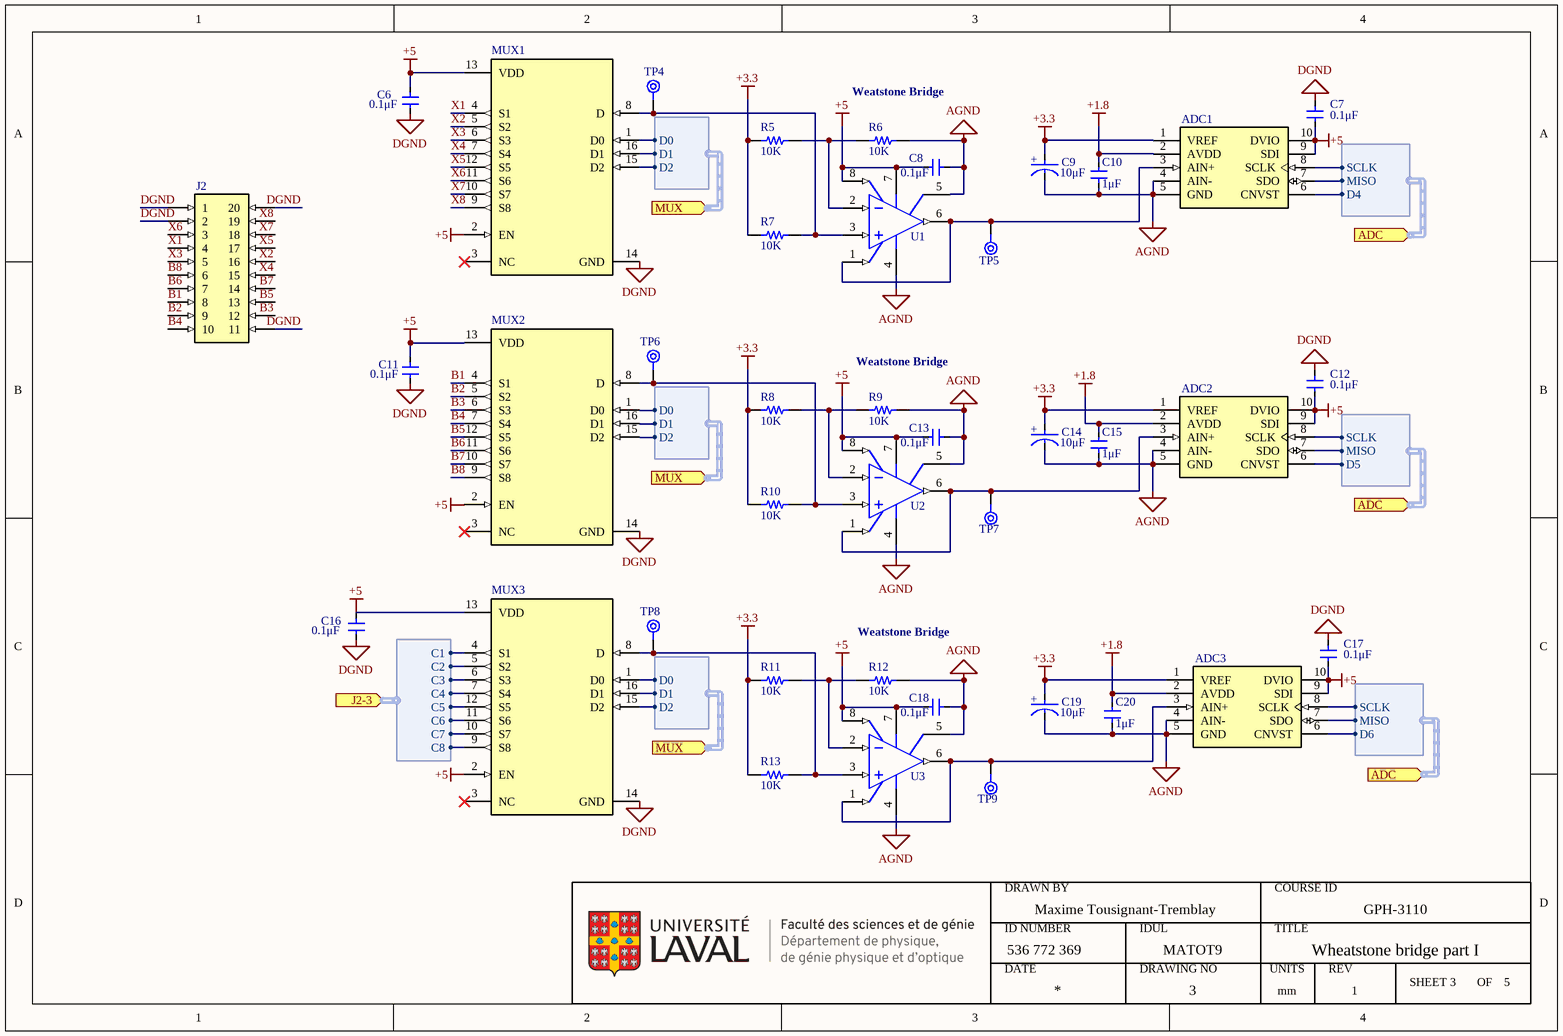
[diagram p2: Wheatstone bridge part I.SchDoc]

### Parts
ADC1  (no value)  [MCP33141-10-E/MS]
ADC2  (no value)  [MCP33141-10-E/MS]
ADC3  (no value)  [MCP33141-10-E/MS]
C6  Capacitance: 0.1μF  [Cap Yaego 0603 MFG]  (hidden comment: CC0603JRX7R9BB104)
C7  Capacitance: 0.1μF  [Cap Ceramic 0.1 uF 50V SMT 0603]  (hidden comment: CC0603JRX7R9BB104)
C8  Capacitance: 0.1μF  [Cap Ceramic 0.1 uF 50V SMT 0603]  (hidden comment: CC0603JRX7R9BB104)
C9  value 10μF  [Cap Tantalum 10 uF 16V SMT 1411]  (hidden comment: Cap 10 uF 16V Tantalum 1411)
C10  value 1μF  [Cap Ceramic 1 uF 16V SMT 0603]  (hidden comment: CC0603KPX7R7BB105)
C11  Capacitance: 0.1μF  [Cap Yaego 0603 MFG]  (hidden comment: CC0603JRX7R9BB104)
C12  Capacitance: 0.1μF  [Cap Ceramic 0.1 uF 50V SMT 0603]  (hidden comment: CC0603JRX7R9BB104)
C13  Capacitance: 0.1μF  [Cap Ceramic 0.1 uF 50V SMT 0603]  (hidden comment: CC0603JRX7R9BB104)
C14  value 10μF  [Cap Tantalum 10 uF 16V SMT 1411]  (hidden comment: Cap 10 uF 16V Tantalum 1411)
C15  value 1μF  [Cap Ceramic 1 uF 16V SMT 0603]  (hidden comment: CC0603KPX7R7BB105)
C16  Capacitance: 0.1μF  [Cap Yaego 0603 MFG]  (hidden comment: CC0603JRX7R9BB104)
C17  Capacitance: 0.1μF  [Cap Ceramic 0.1 uF 50V SMT 0603]  (hidden comment: CC0603JRX7R9BB104)
C18  Capacitance: 0.1μF  [Cap Ceramic 0.1 uF 50V SMT 0603]  (hidden comment: CC0603JRX7R9BB104)
C19  value 10μF  [Cap Tantalum 10 uF 16V SMT 1411]  (hidden comment: Cap 10 uF 16V Tantalum 1411)
C20  value 1μF  [Cap Ceramic 1 uF 16V SMT 0603]  (hidden comment: CC0603KPX7R7BB105)
J2  BF050-20-A-B-0400-0300-L-G  [Headers 20 Pos TH 0.079" 4-3 - B]  (value not drawn)
MUX1  TMUX1208PWR  [TMUX1208PWR]  (value not drawn)
MUX2  TMUX1208PWR  [TMUX1208PWR]  (value not drawn)
MUX3  TMUX1208PWR  [TMUX1208PWR]  (value not drawn)
R5  value 10K  [Res 10K 0.1% SMT 0603]  (hidden comment: Res 10K SMT 0603)
R6  value 10K  [Res 10K 0.1% SMT 0603]  (hidden comment: Res 10K SMT 0603)
R7  value 10K  [Res 10K 0.1% SMT 0603]  (hidden comment: Res 10K SMT 0603)
R8  value 10K  [Res 10K 0.1% SMT 0603]  (hidden comment: Res 10K SMT 0603)
R9  value 10K  [Res 10K 0.1% SMT 0603]  (hidden comment: Res 10K SMT 0603)
R10  value 10K  [Res 10K 0.1% SMT 0603]  (hidden comment: Res 10K SMT 0603)
R11  value 10K  [Res 10K 0.1% SMT 0603]  (hidden comment: Res 10K SMT 0603)
R12  value 10K  [Res 10K 0.1% SMT 0603]  (hidden comment: Res 10K SMT 0603)
R13  value 10K  [Res 10K 0.1% SMT 0603]  (hidden comment: Res 10K SMT 0603)
TP4  Test Point  [SQ Pad]  (value not drawn)  (no BOM)
TP5  Test Point  [SQ Pad]  (value not drawn)  (no BOM)
TP6  Test Point  [SQ Pad]  (value not drawn)  (no BOM)
TP7  Test Point  [SQ Pad]  (value not drawn)  (no BOM)
TP8  Test Point  [SQ Pad]  (value not drawn)  (no BOM)
TP9  Test Point  [SQ Pad]  (value not drawn)  (no BOM)
U1  (no value)  [MCP6N11-100E/SN]
U2  (no value)  [MCP6N11-100E/SN]
U3  (no value)  [MCP6N11-100E/SN]

### Ports
ADC (in, harness 6), ADC (in, harness 7), ADC (in, harness 8), J2-3 (in, harness J2), MUX (in, harness 3), MUX (in, harness 4), MUX (in, harness 5)

### Harnesses
J2: C1, C2, C3, C4, C5, C6, C7, C8
4: D0, D1, D2
5: D0, D1, D2
3: D0, D1, D2
6: SCLK, MISO, D4
7: SCLK, MISO, D5
8: SCLK, MISO, D6

### Nets
+1.8: ADC1.2(AVDD) ADC2.2(AVDD) ADC3.2(AVDD) C10.1 C15.1 C20.1
+3.3: ADC1.1(VREF) ADC2.1(VREF) ADC3.1(VREF) C9.2(A) C14.2(A) C19.2(A) R5.1 R7.1 R8.1 R10.1 R11.1 R13.1
+5: ADC1.9(SDI) ADC1.10(DVIO) ADC2.9(SDI) ADC2.10(DVIO) ADC3.9(SDI) ADC3.10(DVIO) C6.2 C7.1 C8.1 C11.2 C12.1 C13.1 C16.2 C17.1 C18.1 MUX1.2(EN) MUX1.13(VDD) MUX2.2(EN) MUX2.13(VDD) MUX3.2(EN) MUX3.13(VDD) U1.7(VDD) U1.8(EN/~{CAL}) U2.7(VDD) U2.8(EN/~{CAL}) U3.7(VDD) U3.8(EN/~{CAL})
AGND: ADC1.4(AIN-) ADC1.5(GND) ADC2.4(AIN-) ADC2.5(GND) ADC3.4(AIN-) ADC3.5(GND) C8.2 C9.1(C) C10.2 C13.2 C14.1(C) C15.2 C18.2 C19.1(C) C20.2 R6.2 R9.2 R12.2 U1.4(VSS) U1.5(VREF) U2.4(VSS) U2.5(VREF) U3.4(VSS) U3.5(VREF)
DGND: C6.1 C7.2 C11.1 C12.2 C16.1 C17.2 J2.1 J2.2 J2.11 J2.20 MUX1.14(GND) MUX2.14(GND) MUX3.14(GND)
B1: J2.8 MUX2.4(S1)
B2: J2.9 MUX2.5(S2)
B3: J2.12 MUX2.6(S3)
B4: J2.10 MUX2.7(S4)
B5: J2.13 MUX2.12(S5)
B6: J2.7 MUX2.11(S6)
B7: J2.14 MUX2.10(S7)
B8: J2.6 MUX2.9(S8)
D0: MUX1.1(D0) MUX2.1(D0) MUX3.1(D0) ; port MUX.D0
D1: MUX1.16(D1) MUX2.16(D1) MUX3.16(D1) ; port MUX.D1
D2: MUX1.15(D2) MUX2.15(D2) MUX3.15(D2) ; port MUX.D2
D4: ADC1.6(CNVST) ; port ADC.D4
D5: ADC2.6(CNVST) ; port ADC.D5
D6: ADC3.6(CNVST) ; port ADC.D6
MISO: ADC1.7(SDO) ADC2.7(SDO) ADC3.7(SDO) ; port ADC.MISO
SCLK: ADC1.8(SCLK) ADC2.8(SCLK) ADC3.8(SCLK) ; port ADC.SCLK
X1: J2.4 MUX1.4(S1)
X2: J2.16 MUX1.5(S2)
X3: J2.5 MUX1.6(S3)
X4: J2.15 MUX1.7(S4)
X5: J2.17 MUX1.12(S5)
X6: J2.3 MUX1.11(S6)
X7: J2.18 MUX1.10(S7)
X8: J2.19 MUX1.9(S8)
NetADC1_3: ADC1.3(AIN+) TP5.1(TP) U1.1(VFG) U1.6(VOUT)
NetADC2_3: ADC2.3(AIN+) TP7.1(TP) U2.1(VFG) U2.6(VOUT)
NetADC3_3: ADC3.3(AIN+) TP9.1(TP) U3.1(VFG) U3.6(VOUT)
NetJ3_3: MUX3.11(S6) ; port J2-3.C6
NetJ3_4: MUX3.4(S1) ; port J2-3.C1
NetJ3_5: MUX3.5(S2) ; port J2-3.C2
NetJ3_6: MUX3.7(S4) ; port J2-3.C4
NetJ3_16: MUX3.6(S3) ; port J2-3.C3
NetJ3_17: MUX3.12(S5) ; port J2-3.C5
NetJ3_18: MUX3.9(S8) ; port J2-3.C8
NetJ3_19: MUX3.10(S7) ; port J2-3.C7
NetMUX1_8: MUX1.8(D) R7.2 TP4.1(TP) U1.3(VIP)
NetMUX2_8: MUX2.8(D) R10.2 TP6.1(TP) U2.3(VIP)
NetMUX3_8: MUX3.8(D) R13.2 TP8.1(TP) U3.3(VIP)
NetR5_2: R5.2 R6.1 U1.2(VIM)
NetR8_2: R8.2 R9.1 U2.2(VIM)
NetR11_2: R11.2 R12.1 U3.2(VIM)

Not connected (* = marked no-connect by the designer): MUX1 3(NC)*; MUX2 3(NC)*; MUX3 3(NC)*

### Notes on the sheet
- (near R6) Weatstone Bridge
- (near R9) Weatstone Bridge
- (near R12) Weatstone Bridge
- DRAWN BY
- COURSE ID
- ID NUMBER
- DATE
- IDUL
- DRAWING NO
- TITLE
- UNITS
- REV
- SHEET
- OF
- (in symbol Cap 10 uF 16V Tantalum 1411) +

### Library data of the parts
ADC1-ADC3 = ADC 12 bits 1MSPS: 12 Bit Analog to Digital Converter 1 Input 1 SAR 10-MSOP; Supplier 1: Digi-Key; Supplier Part Number 1: MCP33141-10-E/MS-ND
C6-C8 C11-C13 C16-C18 = Cap Ceramic 0.1 uF SMT 0603: 0.1 µF ±5% 50V Ceramic Capacitor X7R 0603 (1608 Metric); manufacturer: Yageo; Part Number: CC0603JRX7R9BB104; Applications: General Purpose; componentlink1description: Datasheet; componentlink1url: https://www.yageo.com/upload/media/product/productsearch/datasheet/mlcc/UPY-GPHC_X7R_6.3V-to-50V_18.pdf; componentlink2description: DigiKey Link; componentlink2url: https://www.digikey.com/en/products/detail/yageo/CC0603JRX7R9BB104/5195188; Device Package: 0603 (1608 Metric); lastupdated: 2023-03-06 20:08:09; Lifecycle Status: Active; Minimum Order: 1; Mounting Type: Surface Mount, MLCC; Operating Temperature: -55°C ~ 125°C; Package / Case: 0603 (1608 Metric); packaging: TapeAndReel; partid: 12474; Part Status: Active; price: 0.01; series: CC; Size / Dimension: 0.063" L x 0.031" W (1.60mm x 0.80mm); Temperature Coefficient: X7R; Thickness (Max): 0.035" (0.90mm); Tolerance: ±5%; Voltage - Rated: 50V; Supplier 1: Digi-Key; Supplier Part Number 1: 311-1779-1-ND; Supplier 2: Digi-Key; Supplier Part Number 2: 311-1779-6-ND; Supplier 3: Digi-Key; Supplier Part Number 3: 311-1779-2-ND
C9 C14 C19 = Cap 10 uF 16V Tantalum 1411: 10 µF Molded Tantalum Capacitors 16 V 1411 (3528 Metric) 2Ohm; Voltage Rating: 16V; Case Code (Imperial): 1411; Supplier 1: Digi-Key; Supplier Part Number 1: 718-1124-1-ND; Supplier 2: Digi-Key; Supplier Part Number 2: 718-1124-6-ND; Supplier 3: Digi-Key; Supplier Part Number 3: 718-1124-2-ND
C10 C15 C20 = Cap Ceramic 1 uF SMT 0603: 1 µF ±10% 16V Ceramic Capacitor X7R 0603 (1608 Metric); Dielectric: XR7; Tolerance: 10%; Max Operating Temperature: 125°C; Case Code (Imperial): 0603; Voltage Rating (DC): 16V; Resistor Type: Ceramic; Height: 0.8mm; Length: 1.6mm; Construction: Flat; Termination: SMT/SMD; Min Operating Temperature: -55°C; Supplier 1: Digi-Key; Supplier Part Number 1: 13-CC0603KPX7R7BB105CT-ND; Supplier 2: Digi-Key; Supplier Part Number 2: 13-CC0603KPX7R7BB105DKR-ND; Supplier 3: Digi-Key; Supplier Part Number 3: 13-CC0603KPX7R7BB105TR-ND
J2 = Headers 20 Pos TH 0.079" 4-3: Connector Header Through Hole 20 position 0.079" (2.00mm); Supplier 1: Digi-Key; Supplier Part Number 1: 2073-BF050-20-A-B-0400-0300-L-G-ND
MUX1-MUX3 = MUX Analog 8:1: 5-V, 8: 1, 1-channel general-purpose analog multiplexer with 1.8-V input logic 16-TSSOP -40 to 125; Supplier 1: Digi-Key; Supplier Part Number 1: 296-51847-1-ND; Supplier 2: Digi-Key; Supplier Part Number 2: 296-51847-6-ND; Supplier 3: Digi-Key; Supplier Part Number 3: 296-51847-2-ND; ComponentLink1Description: Datasheet; ComponentLink1URL: https://www.ti.com/lit/ds/symlink/tmux1208.pdf?HQS=dis-dk-null-digikeymode-dsf-pf-null-wwe&ts=1678139087624&ref_url=https%253A%252F%252Fwww.ti.com%252Fgeneral%252Fdocs%252Fsuppproductinfo.tsp%253FdistId%253D10%2526gotoUrl%253Dhttps%253A%252F%252Fwww.ti.com%252Flit%252Fgpn%252Ftmux1208
R5-R13 = Res 10K SMT 0603: 10 kΩ  ±0.1% 0.1W, 1/10W Chip Resistor 0603 (1608 Metric) Thin Film; Part Number: RT0603BRD0710KL; Manufacturer: Yageo; Temperature Coefficient: ±25ppm/°C; ComponentLink1Description: Datasheet; ComponentLink1URL: https://www.yageo.com/upload/media/product/productsearch/datasheet/rchip/PYu-RT_1-to-0.01_RoHS_L_11.pdf; ComponentLink2Description: DigiKey Link; ComponentLink2URL: https://www.digikey.com/en/products/detail/yageo/RT0603BRD0710KL/1072198; Composition: Thin Film; Device Package: 0603 (1608 Metric); Height - Seated (Max): 0.022" (0.55mm); LastUpdated: 2023-03-06 20:27:57; Lifecycle Status: Active; Minimum Order: 1; Number of Terminations: 2; Operating Temperature: -55°C ~ 155°C; Package / Case: 0603 (1608 Metric); Packaging: TapeAndReel; PartId: 22611; Part Status: Active; Power (Watts): 0.1W, 1/10W; Price: 0.03; Resistance: 10K; Series: RT; Size / Dimension: 0.063" L x 0.031" W (1.60mm x 0.80mm); Supplier Device Package: 0603; Tolerance: ±0.1%; Supplier 1: Digi-Key; Supplier Part Number 1: YAG1236CT-ND; Supplier 2: Digi-Key; Supplier Part Number 2: YAG1236DKR-ND; Supplier 3: Digi-Key; Supplier Part Number 3: YAG1236TR-ND
U1-U3 = Instrumentation Op Amp 35 MHz 8 pins: Instrumentation Amplifier 1 Circuit Rail-to-Rail 8-SOIC; Supplier 1: Digi-Key; Supplier Part Number 1: MCP6N11-100E/SN-ND